# EAGLE design usb_tester-2.01 (EAGLE 6.3)
TITLE: USB TESTER
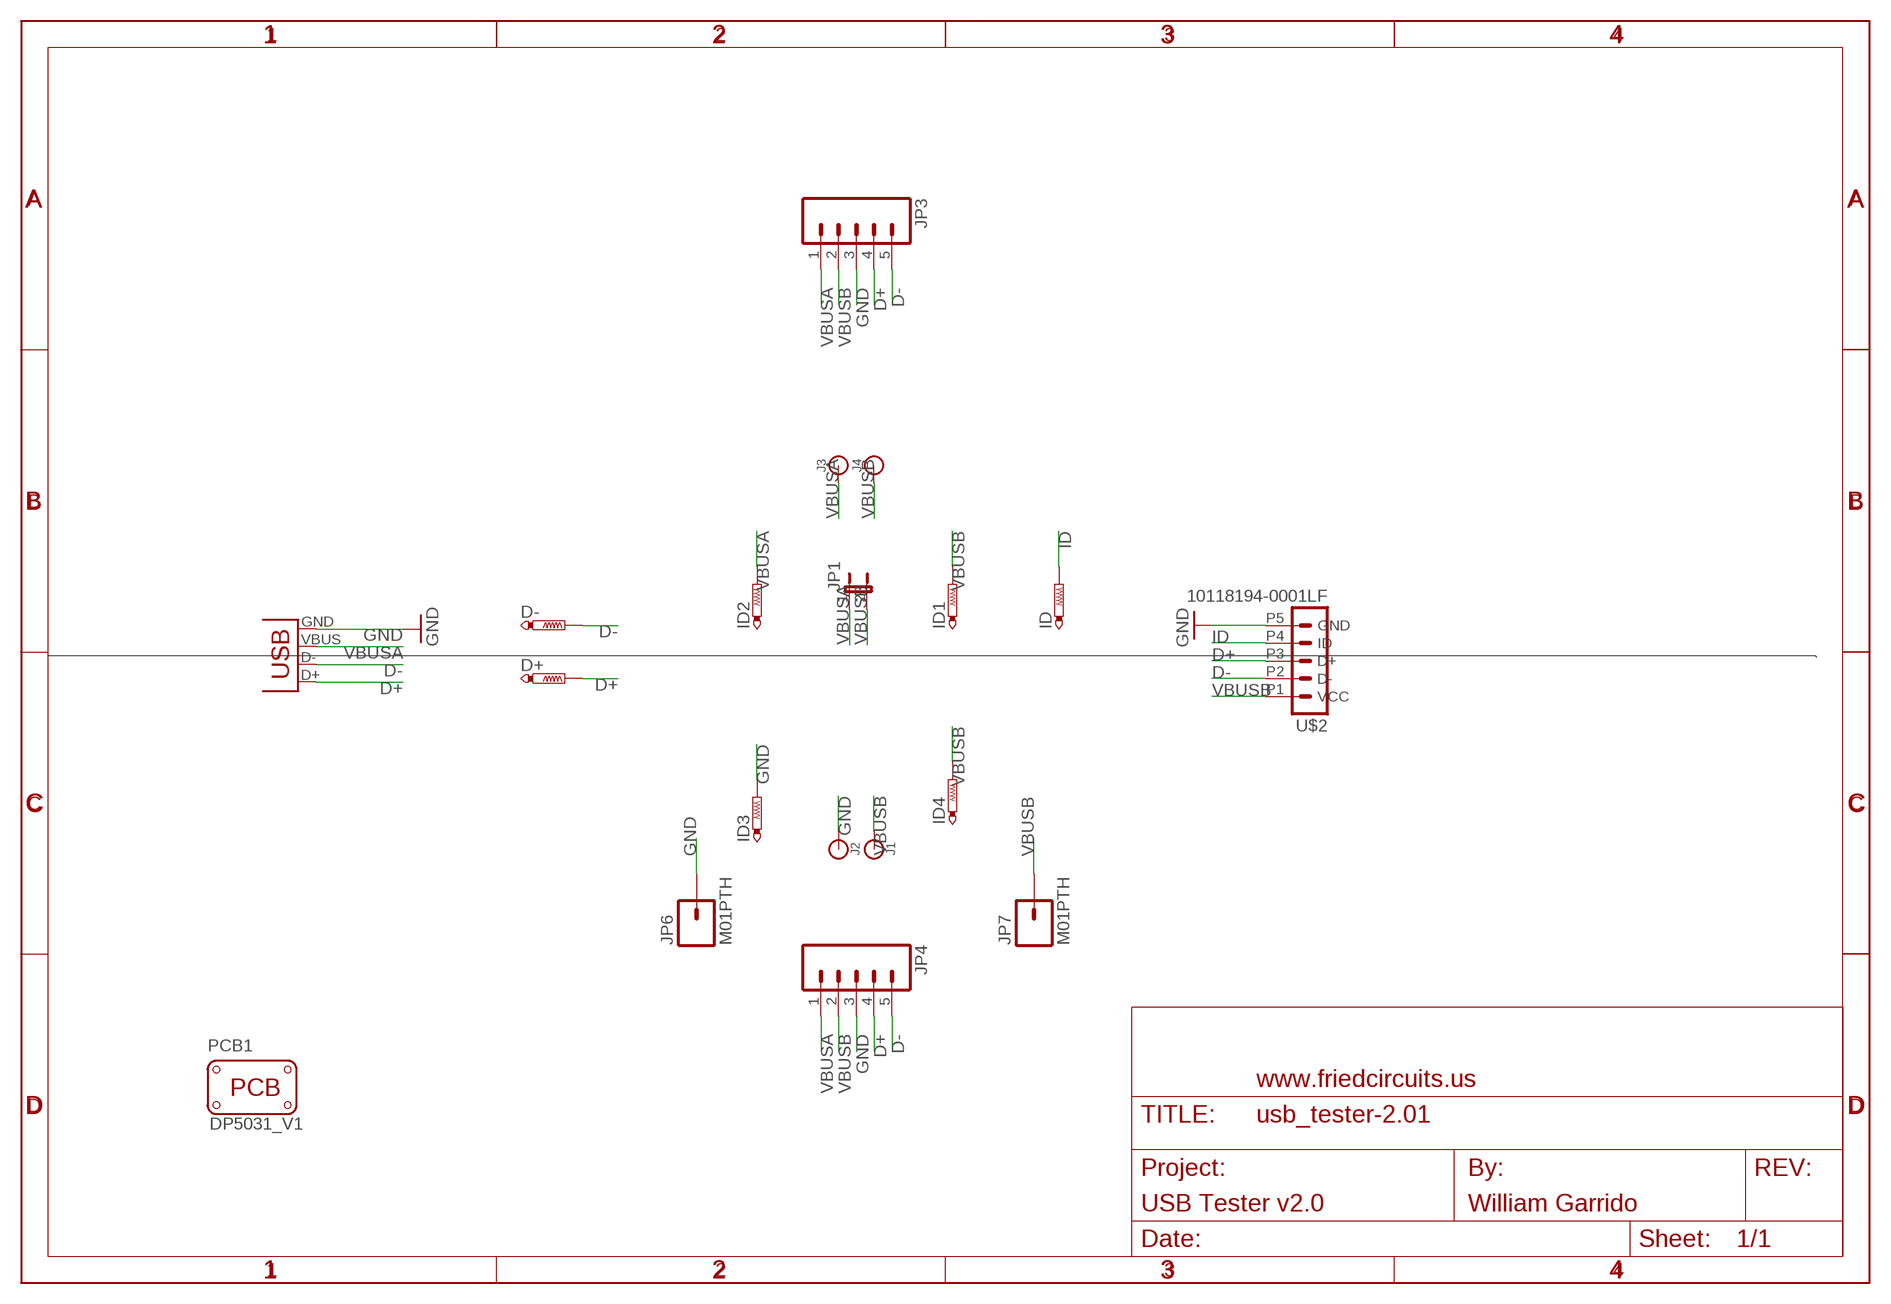
[diagram p0: schematic, sheet 1]

## Parts
D+  PTR1PAD1-20  [P1-20]
D-  PTR1PAD1-20  [P1-20]
ID  PTR1PAD1-20  [P1-20]
ID1  PTR1PAD1-20  [P1-20]
ID2  PTR1PAD1-20  [P1-20]
ID3  PTR1PAD1-20  [P1-20]
ID4  PTR1PAD1-20  [P1-20]
J1  BANANA_CONN  [BANANA_CONN]
J2  BANANA_CONN  [BANANA_CONN]
J3  BANANA_CONN  [BANANA_CONN]
J4  BANANA_CONN  [BANANA_CONN]
JP1  JUMPER-2PTH_LOCK  [1X02_LOCK]
JP3  M05LOCK  [1X05_LOCK]
JP4  M05LOCK  [1X05_LOCK]
JP6  M01PTH  [1X01]
JP7  M01PTH  [1X01]
PCB1  PCB_DP_RECTANGLE-31X50  [DP5031_V1]
U$1  FRAME_DINA4_L  [FC_CREDIT]
U$2  10118194-0001LF  [10118194-0001LF]
USB-DEVICE  USB-A-SMD  [USB-A-S-NOSILK-FEMALE]

## Nets
D+: D+.TP JP3.4 JP4.4 U$2.P3(D+) USB-DEVICE.D+
D-: D-.TP JP3.5 JP4.5 U$2.P2(D-) USB-DEVICE.D-
GND: ID3.TP J2.P$1 JP3.3 JP4.3 JP6.1 U$2.P5(GND) USB-DEVICE.GND
ID [ID]: ID.TP U$2.P4(ID)
VBUSA [VBUS]: ID2.TP J3.P$1 JP1.1 JP3.1 JP4.1 USB-DEVICE.VBUS
VBUSB [VBUS]: ID1.TP ID4.TP J1.P$1 J4.P$1 JP1.2 JP3.2 JP4.2 JP7.1 U$2.P1(VCC)

## Library data of the parts
D+ D- ID ID1-ID4 = testpad:PTR1: TEST PIN
J1-J4 = SparkFun-Connectors:BANANA_CONN: Through-hole banana jack
JP1 = SparkFun-Passives:JUMPER-2: Jumper Basic 0.1" spaced jumper. Use with breakaway headers.
JP3 JP4 = SparkFun-Connectors:M05: Header 5 Standard 5-pin 0.1" header. Use with straight break away headers (SKU : PRT-00116), right angle break away headers (PRT-00553), swiss pins (PRT-00743), machine pins (PRT-00117), and female headers (PRT-00115). Molex polarized connector foot print use with SKU : PRT-08230 with associated crimp pins and housings.
JP6 JP7 = SparkFun-Connectors:M01: Header 1 Standard 1-pin 0.1" header. Use with straight break away headers (SKU : PRT-00116), right angle break away headers (PRT-00553), swiss pins (PRT-00743), machine pins (PRT-00117), and female headers (PRT-00115).
PCB1 = dp_devices:PCB_DP_RECTANGLE: Dangerous Prototypes Standard Rectangular PCB sizes; PCB_SIZE: DP5031_V1
U$1 = FriedCircuits:FRAME_DINA4_L: A4 FC frame Standard FriedCircuits schematic frame. Automagically adds the standard texts to the PCB Use the atrribute in the schematic editor to change the fields.; AUTHOR: William Garrido; FF1: fulfillment by; FF2: FriedCircuits; FF3: friedcircuits.us; PROJECT: USB Tester v2.0; URL2: www.friedcircuits.us
U$2 = FriedCircuits:10118194-0001LF: Thanks to Leon Marure for this footprint https://mywebspace.wisc.edu/lnmaurer/web/FloatingAway/FloatingAway.html leon.maurer@gmail.com https://mywebspace.wisc.edu/lnmaurer/web/ Friedcircuits - Added ID pin to schamtic.
USB-DEVICE = SparkFun-Connectors:USB: USB Connectors USB-B-PTH is fully proven SKU : PRT-00139/CONN-08278 USB-miniB is fully proven SKU : PRT-00587 USB-A-PCB is untested. USB-A-H is throughly reviewed, but untested. Spark Fun Electronics SKU : PRT-00437 USB-B-SMT is throughly reviewed, but untested. Needs silkscreen touching up. USB-A-S has not been used/tested USB-MB-H has not been used/tested USB-MICROB has been used. CONN-09505; PROD_ID: CONN-09520

## Net classes
0 default: width 0.254 mm, drill 0.254 mm
1 VBUS: width 0.61 mm, drill 0.254 mm
2 ID: width 0.254 mm, drill 0.254 mm

## Board
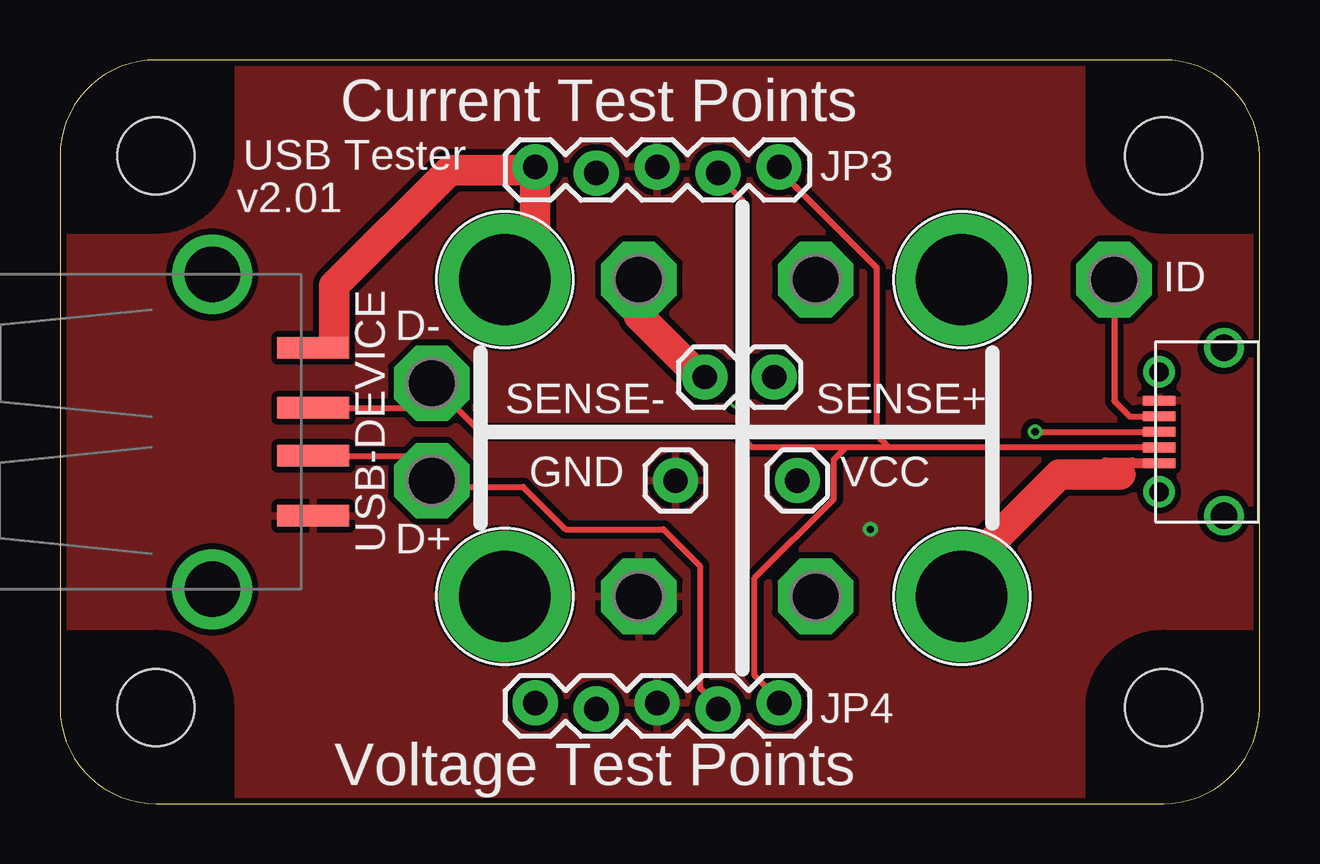
[diagram p1: board, top side]
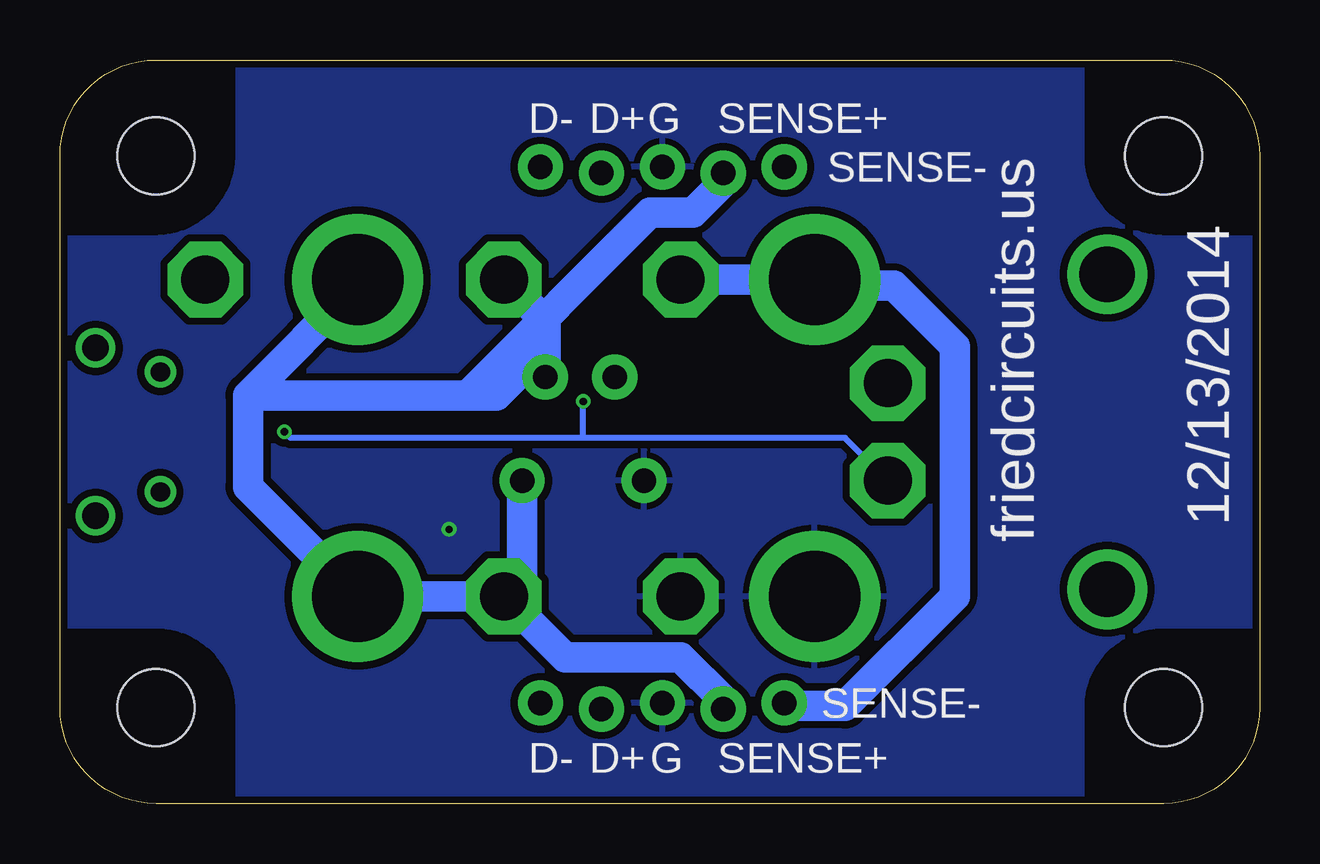
[diagram p2: board, bottom side, seen from below]

Size 50 x 31 mm. Coordinates in mm from the lower left corner, seen from the top.
Copper layers (1*16): Top 0.035mm / dielectric 1.5mm / Bottom 0.035mm
Design rules "Fusion_eagle_rule_v1.1": minimum track width 6mil, minimum drill 12mil, track to track 6mil, track to pad 6mil, pad to pad 6mil, via to via 6mil, smd to smd 0mil, copper to edge 10mil, drill to drill 10mil, minimum pad ring 10mil, minimum via ring 6mil, stop-mask expansion 2mil, vias tented up to drill 100mil, thermal gap 10mil

### Footprints (pad centres in the part's own frame; a part is rotated, then mirrored left to right if it is on the bottom)
P1-20 = drill 2.007 pad 3.15 octagon: TP 0,0
BANANA_CONN = drill 3.81 pad 5.461: P$1 0,0
1X02_LOCK = drill 1.016 pad 1.88: 1 -0.178,0; 2 2.718,0
1X05_LOCK = drill 1.016 pad 1.88: 1 0,0.127; 2 2.54,-0.127; 3 5.08,0.127; 4 7.62,-0.127; 5 10.16,0.127
1X01 = drill 1.016 pad 1.88: 1 0,0
DP5031_V1 = hole 3.2: 4,4; 46,4; 46,27; 4,27
10118194-0001LF = smd 0.4 x 1.35: P1 -1.3,2.7; P2 -0.65,2.7; P3 0,2.7; P4 0.65,2.7; P5 1.3,2.7 | drill 1.1: P$1 -3.5,0; P$2 3.5,0 | drill 0.8: P$3 -2.5,2.7; P$4 2.5,2.7
USB-A-S-NOSILK-FEMALE = smd 3 x 0.9: D+ 4.212,-1; D- 4.212,1; GND 4.212,-3.5; VBUS 4.212,3.5 | drill 2.311: P$5 0,-6.566; P$6 0,6.566

### Placement (x,y rotation side)
D+  15.49,13.46 0 top
D-  15.49,17.53 0 top
ID  43.94,21.84 0 top
ID1  31.5,21.84 0 top
ID2  24.13,21.84 0 top
ID3  24.13,8.64 0 top
ID4  31.5,8.64 0 top
J1  37.59,8.64 0 top
J2  18.54,8.64 0 top
J3  18.54,21.84 0 top
J4  37.59,21.84 0 top
JP1  27.05,17.78 0 top
JP3  19.81,26.42 0 top
JP4  19.81,4.06 0 top
JP6  25.65,13.46 0 top
JP7  30.73,13.46 0 top
PCB1  0,0 0 top
U$1  -2.54,-5.08 0 top  (outside the outline)
U$2  48.51,15.49 90 top
USB-DEVICE  6.35,15.49 0 top

### Tracks (layer width: path | path; a pad name or v marks a point on that pad's centre or on a via)
D+  (via drill 0.3)
  Top 0.254: USB-DEVICE.D+ 14.46,14.49 D+.TP 15.49,13.21 19.3,13.21 21.08,11.43 25.15,11.43 26.67,9.91 26.67,4.83 27.43,4.06 JP4.4 | v40.64,15.49 U$2.P3 | v28.19,16.76 28.45,17.02 28.45,25.15 27.43,26.16 JP3.4
  Bottom 0.254: v40.64,15.49 40.39,15.24 28.19,15.24 | 28.19,15.24 17.27,15.24 D+.TP | 27.43,4.06 JP4.4 | 28.19,15.24 v28.19,16.76
D-
  Top 0.254: USB-DEVICE.D- 14.46,16.49 D-.TP 17.53,15.49 28.19,15.49 28.84,14.84 32.77,14.84 | U$2.P2 34.54,14.84 | 34.54,14.84 32.77,14.84 | JP4.5 29.97,4.32 28.96,5.33 28.96,9.4 32.26,12.7 32.26,14.34 32.77,14.84 | JP3.5 29.97,26.42 34.04,22.35 34.04,15.35 34.54,14.84
GND  (via drill 0.3)
  other vias: 33.78,11.43
  pour Top (isolate 0.254): 0,0 0,31.75 50.8,31.75 50.8,0
  pour Bottom (isolate 0.305): 0,0 50.8,0 50.8,31.75 0,31.75
ID
  Top 0.254: ID.TP 43.94,16.79 44.6,16.13 45.8,16.13 U$2.P4
N$1
  Top 0.406: 43.59,14.22 44.68,14.22
VBUSA
  Top 0.61: 11.68,19.05 USB-DEVICE.VBUS 11.43,19.05 11.18,19.05 11.43,19.3 | 26.67,17.78 JP1.1 | 19.68,26.42 JP3.1
  Top 1.27: 26.67,17.78 24.13,20.32 ID2.TP | J3.P$1 19.81,23.11 JP3.1 | 19.68,26.42 16.26,26.42 11.43,21.59 11.43,19.3
  Bottom 0.61: J3.P$1 18.29,21.59 | 19.68,4.06 JP4.1
  Bottom 1.27: J3.P$1 ID2.TP | 19.68,4.06 17.27,4.06 12.7,8.64 12.7,19.05 15.24,21.59 18.29,21.59
VBUSB
  Top 0.406: U$2.P1 44.2,14.19 44.2,13.72
  Top 1.27: J1.P$1 37.59,9.65 41.66,13.72 44.2,13.72
  Bottom 0.61: 37.59,8.89 J1.P$1 | 22.48,26.42 JP3.2 | J4.P$1 37.59,21.59 | 30.73,9.4 ID4.TP
  Bottom 1.27: 42.16,17.02 42.16,13.21 J1.P$1 ID4.TP 28.96,6.1 24.13,6.1 22.35,4.32 JP4.2 | 37.59,21.59 42.16,17.02 | JP7.1 30.73,9.4 | 42.16,17.02 33.02,17.02 | JP3.2 22.35,25.91 23.62,24.64 25.4,24.64 33.02,17.02 | JP1.2 29.77,19.05 | 29.77,19.05 29.77,20.12 ID1.TP | 33.02,17.02 31.8,17.02 29.77,19.05

### Text on the board
tPlace: Current Test Points | USB Tester | v2.01 | SENSE- | SENSE+ | GND | VCC | Voltage Test Points
bPlace: G | SENSE+ | D+ | D- | friedcircuits.us | SENSE- | 12/13/2014 | SENSE- | SENSE+ | G | D+ | D-